# EAGLE design TX (EAGLE 6.5.0)
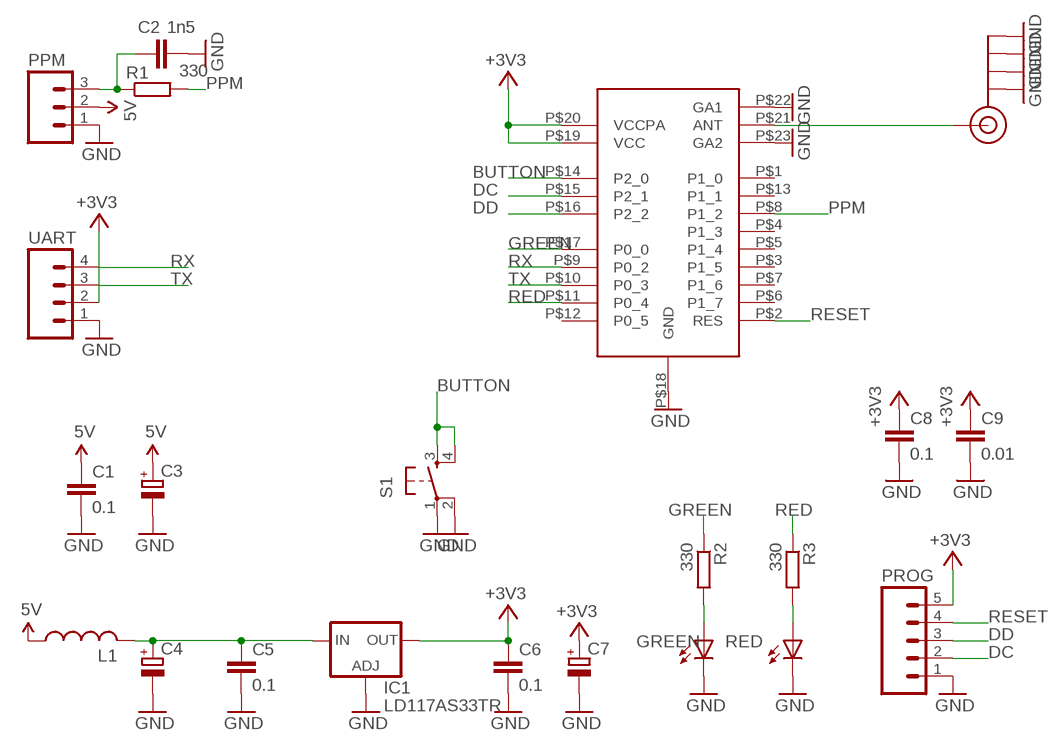
[diagram p0: schematic, sheet 1]

## Parts
C1  0.1  C-EUC0603  [C0603]
C2  1n5  C-EUC0603  [C0603]
C3  CPOL-EUCT3216  [CT3216]
C4  CPOL-EUCT3216  [CT3216]
C5  0.1  C-EUC0603  [C0603]
C6  0.1  C-EUC0603  [C0603]
C7  CPOL-EUCT3216  [CT3216]
C8  0.1  C-EUC0603  [C0603]
C9  0.01  C-EUC0603  [C0603]
GREEN  LEDCHIPLED_1206  [CHIPLED_1206]
IC1  LD117AS33TR  [SOT223]
J$1  SMA_EDGE  [SMA-EDGE]
L1  L-USL2012C  [L2012C]
PPM  M03PTH  [1X03]
PROG  M05PTH  [1X05]
R1  330  R-EU_MELF0102R  [MINI_MELF-0102R]
R2  330  R-EU_MELF0102R  [MINI_MELF-0102R]
R3  330  R-EU_MELF0102R  [MINI_MELF-0102R]
RED  LEDCHIPLED_1206  [CHIPLED_1206]
S1  TAC_SWITCHSMD  [TACTILE_SWITCH_SMD]
U$1  CC1110_PA  [CC1110_PA]
UART  M04PTH  [1X04]

## Nets
5V: C1.1 C3.+ L1.1 PPM.2
+3V3: C6.1 C7.+ C8.1 C9.1 IC1.4(OUT) PROG.5 U$1.P$19(VCC) U$1.P$20(VCCPA) UART.2
BUTTON: S1.3 S1.4 U$1.P$14(P2_0)
DC: PROG.2 U$1.P$15(P2_1)
DD: PROG.3 U$1.P$16(P2_2)
GND: C1.2 C2.2 C3.- C4.- C5.2 C6.2 C7.- C8.2 C9.2 GREEN.C IC1.1(ADJ) J$1.GND@0(GND) J$1.GND@1(GND) J$1.GND@2(GND) J$1.GND@3(GND) PPM.1 PROG.1 RED.C S1.1 S1.2 U$1.P$18(GND) U$1.P$22(GA1) U$1.P$23(GA2) UART.1
GREEN: R2.1 U$1.P$17(P0_0)
N$1: J$1.SIG(SIGNAL) U$1.P$21(ANT)
N$2: C4.+ C5.1 IC1.3(IN) L1.2
N$3: GREEN.A R2.2
N$4: R3.2 RED.A
N$9: C2.1 PPM.3 R1.1
PPM: R1.2 U$1.P$8(P1_2)
RED: R3.1 U$1.P$11(P0_4)
RESET: PROG.4 U$1.P$2(RES)
RX: U$1.P$9(P0_2) UART.4
TX: U$1.P$10(P0_3) UART.3
Unconnected: U$1.P$1(P1_0) U$1.P$3(P1_5) U$1.P$4(P1_3) U$1.P$5(P1_4) U$1.P$6(P1_7) U$1.P$7(P1_6) U$1.P$12(P0_5) U$1.P$13(P1_1)

## Library data of the parts
C1 C2 C5 C6 C8 C9 = resistor:C-EU: CAPACITOR, European symbol
C3 C4 C7 = rcl:CPOL-EU: POLARIZED CAPACITOR, European symbol
GREEN RED = led:LED: LED OSRAM: - CHIPLED LG R971, LG N971, LY N971, LG Q971, LY Q971, LO R971, LY R971 LH N974, LH R974 LS Q976, LO Q976, LY Q976 LO Q996 - Hyper CHIPLED LW Q18S LB Q993, LB Q99A, LB R99A - SideLED LS A670, LO A670, LY A670, LG A670, LP A670 LB A673, LV A673, LT A673, LW A673 LH A674 LY A675 LS A676, LA A676, LO A676, LY A676, LW A676 LS A679, LY A679, LG A679 - Hyper Micro SIDELED® LS Y876, LA Y876, LO Y876, LY Y876 LT Y87S - SmartLED LW L88C, LW L88S LB L89C, LB L89S, LG L890 LS L89K, LO L89K, LY L89K LS L896, LA L896, LO L896, LY L896 - TOPLED LS T670, LO T670, LY T670, LG T670, LP T670 LSG T670, LSP T670, LSY T670, LOP T670, LYG T670 LG T671, LOG T671, LSG T671 LB T673, LV T673, LT T673, LW T673 LH T674 LS T676, LA T676, LO T676, LY T676, LB T676, LH T676, LSB T676, LW T676 LB T67C, LV T67C, LT T67C, LS T67K, LO T67K, LY T67K, LW E67C LS E67B, LA E67B, LO E67B, LY E67B, LB E67C, LV E67C, LT E67C LW T67C LS T679, LY T679, LG T679 LS T770, LO T770, LY T770, LG T770, LP T770 LB T773, LV T773, LT T773, LW T773 LH T774 LS E675, LA E675, LY E675, LS T675 LS T776, LA T776, LO T776, LY T776, LB T776 LHGB T686 LT T68C, LB T68C - Hyper Mini TOPLED® LB M676 - Mini TOPLED Santana® LG M470 LS M47K, LO M47K, LY M47K Source: http://www.osram.convergy.de LUXEON: - LUMILED® LXK2-PW12-R00, LXK2-PW12-S00, LXK2-PW14-U00, LXK2-PW14-V00 LXK2-PM12-R00, LXK2-PM12-S00, LXK2-PM14-U00 LXK2-PE12-Q00, LXK2-PE12-R00, LXK2-PE12-S00, LXK2-PE14-T00, LXK2-PE14-U00 LXK2-PB12-K00, LXK2-PB12-L00, LXK2-PB12-M00, LXK2-PB14-N00, LXK2-PB14-P00, LXK2-PB14-Q00 LXK2-PR12-L00, LXK2-PR12-M00, LXK2-PR14-Q00, LXK2-PR14-R00 LXK2-PD12-Q00, LXK2-PD12-R00, LXK2-PD12-S00 LXK2-PH12-R00, LXK2-PH12-S00 LXK2-PL12-P00, LXK2-PL12-Q00, LXK2-PL12-R00 Source: www.luxeon.com KINGBRIGHT: KA-3528ASYC Source: www.kingbright.com
IC1 = v-reg:LD117A?*: Low drop fixed and adjustable positive voltage regulators 1 A Source: http://www.st.com/stonline/products/literature/ds/7194/ld1117axx.pdf
J$1 = SparkFun:SMA_EDGE: SMA Antenna Connector End launch SMA connector. The paste layer has been removed so that the connector can be hand soldered onto the board after reflow.
L1 = resistor:L-US: INDUCTOR, American symbol
PPM = SparkFun-Connectors:M03: Header 3 Standard 3-pin 0.1" header. Use with straight break away headers (SKU : PRT-00116), right angle break away headers (PRT-00553), swiss pins (PRT-00743), machine pins (PRT-00117), and female headers (PRT-00115). Molex polarized connector foot print use with SKU : PRT-08232 with associated crimp pins and housings.
PROG = SparkFun-Connectors:M05: Header 5 Standard 5-pin 0.1" header. Use with straight break away headers (SKU : PRT-00116), right angle break away headers (PRT-00553), swiss pins (PRT-00743), machine pins (PRT-00117), and female headers (PRT-00115). Molex polarized connector foot print use with SKU : PRT-08230 with associated crimp pins and housings.
R1-R3 = resistor:R-EU_: RESISTOR, European symbol
S1 = SparkFun-Electromechanical:TAC_SWITCH: Momentary Switch Button commonly used for reset or general input. Spark Fun Electronics SKU : COM-00097 SMT- SWCH-08247; PROD_ID: SWCH-08247
U$1 = Stefan:CC1110_PA
UART = SparkFun-Connectors:M04: Header 4 Standard 4-pin 0.1" header. Use with straight break away headers (SKU : PRT-00116), right angle break away headers (PRT-00553), swiss pins (PRT-00743), machine pins (PRT-00117), and female headers (PRT-00115). Molex polarized connector foot print use with SKU : PRT-08231 with associated crimp pins and housings. 1MM SMD Version SKU: PRT-10208

## Board
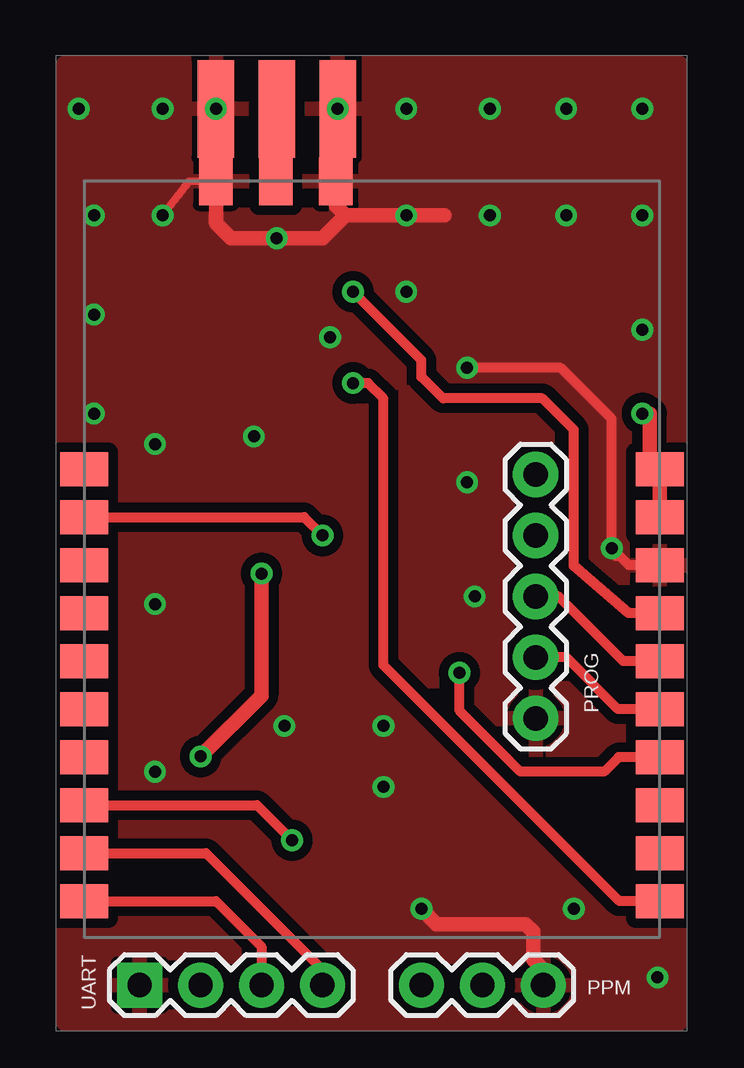
[diagram p1: board, top side]
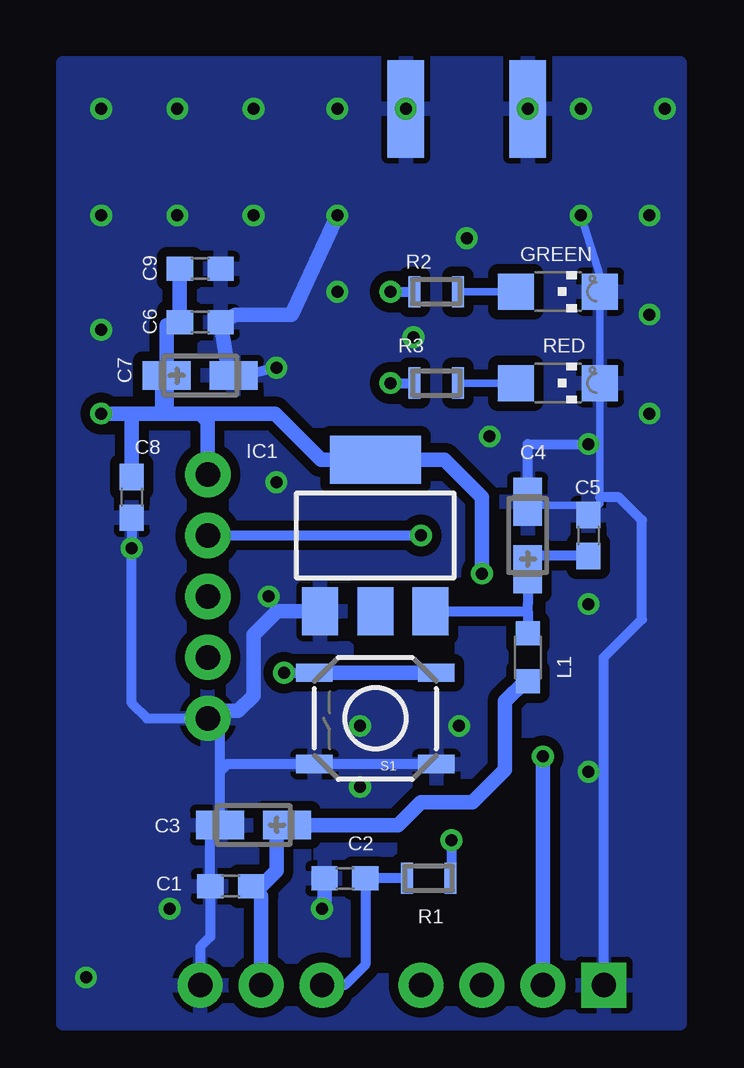
[diagram p2: board, bottom side, seen from below]

No outline drawn. Coordinates in mm, seen from the top.
Copper layers (1*16): Top 0.035mm / dielectric 1.5mm / Bottom 0.035mm
Design rules "default *": minimum track width 10mil, minimum drill 24mil, track to track 8mil, track to pad 8mil, pad to pad 8mil, via to via 8mil, smd to smd 8mil, copper to edge 40mil, drill to drill 8mil, minimum pad ring 10mil, minimum via ring 8mil, stop-mask expansion 4mil, vias tented up to drill 20mil, thermal gap 10mil

### Footprints (pad centres in the part's own frame; a part is rotated, then mirrored left to right if it is on the bottom)
C0603 = smd 1.1 x 1: 1 -0.85,0; 2 0.85,0
CT3216 = smd 2 x 1.2: + -1.4,0; - 1.4,0
CHIPLED_1206 = smd 1.5 x 1.5: A 0,-1.75; C 0,1.75
SOT223 = smd 1.5 x 2: 1 -2.3,-3.15; 2 0,-3.15; 3 2.3,-3.15 | smd 3.8 x 2: 4 0,3.15
SMA-EDGE = smd 1.524 x 4.064: GND@0 0,0; GND@1 5.08,0; SIG 2.54,0 | smd 1.524 x 4.064 bottom: GND@2 0,0; GND@3 5.08,0
L2012C = smd 1 x 1: 1 -1,0; 2 1,0
1X03 = drill 1.016 pad 1.88: 1 0,0; 2 2.54,0; 3 5.08,0
1X05 = drill 1.016 pad 1.88: 1 0,0; 2 2.54,0; 3 5.08,0; 4 7.62,0; 5 10.16,0
MINI_MELF-0102R = smd 0.5 x 1.3: 1 -0.9,0; 2 0.9,0
TACTILE_SWITCH_SMD = smd 1.524 x 0.762: 1 -2.54,1.905; 2 2.54,1.905; 3 -2.54,-1.905; 4 2.54,-1.905
CC1110_PA = smd 2 x 1.4: P$1 -5.5,18; P$2 -5.5,16; P$3 -5.5,14; P$4 -5.5,12; P$5 -5.5,10; P$6 -5.5,8; P$7 -5.5,6; P$8 -5.5,4; P$9 -5.5,2; P$10 -5.5,0; P$11 18.5,0; P$12 18.5,2; P$13 18.5,4; P$14 18.5,6; P$15 18.5,8; P$16 18.5,10; P$17 18.5,12; P$18 18.5,14; P$19 18.5,16; P$20 18.5,18 | smd 1.4 x 2: P$21 2.5,30; P$22 0,30; P$23 5,30
1X04 = drill 1.016 pad 1.88 square: 1 0,0 | drill 1.016 pad 1.88: 2 2.54,0; 3 5.08,0; 4 7.62,0

### Placement (x,y rotation side)
C1  20,12.06 180 bottom
C2  15.24,12.38 180 bottom
C3  19.05,14.61 180 bottom
C4  7.62,26.67 90 bottom
C5  5.08,26.67 90 bottom
C6  21.27,35.56 0 bottom
C7  21.27,33.34 0 bottom
C8  24.13,28.26 270 bottom
C9  21.27,37.78 0 bottom
GREEN  6.35,36.83 270 bottom
IC1  13.97,26.67 0 bottom
J$1  7.62,44.45 0 top
L1  7.62,21.59 90 bottom
PPM  21.27,7.94 180 top
PROG  20.95,19.05 90 top
R1  11.75,12.38 0 bottom
R2  11.43,36.83 0 bottom
R3  11.43,33.02 0 bottom
RED  6.35,33.02 270 bottom
S1  13.97,19.05 180 bottom
U$1  7.62,11.43 0 top
UART  4.45,7.94 0 top

### Tracks (layer width: path | path; a pad name or v marks a point on that pad's centre or on a via)
5V
  Bottom 0.61: PPM.2 18.73,11.64 C1.1 18.73,12.06 18.1,12.7 18.1,14.16 C3.+ 13.02,14.61 12.06,15.56 9.92,15.56 8.57,16.91 8.57,19.77 7.71,20.59 L1.1
+3V3  (via drill 0.5)
  Top 0.61: U$1.P$19 U$1.P$20 25.5,29.43 25.72,29.53 25.72,31.75 v25.4,31.75 | v9.53,25.08 9.53,20 v6.99,17.46
  Bottom 0.61: C8.1 24.13,31.75 v25.4,31.75 22.86,31.75 | 21.27,31.75 18.16,31.75 16.23,29.82 IC1.4 11.09,29.82 9.53,28.26 v9.53,25.08 | 21.27,31.75 22.86,31.75 | 22.86,31.75 22.86,33.15 C7.+ | C7.+ 22.67,35.43 22.23,35.56 arc-90 22.12,35.66 | 22.12,35.66 C6.1 | C7.+ 22.67,31.94 22.86,31.75 | v6.99,17.46 UART.2 | PROG.5 20.95,31.43 21.27,31.75 | 22.12,35.66 C9.1
BUTTON  (via drill 0.5)
  Top 0.406: U$1.P$14 24.41,17.43 23.81,16.83 20.32,16.83 17.78,19.37 v17.78,20.95
  Bottom 0.406: v17.78,20.95 S1.4
  Bottom 0.61: S1.3 S1.4
DC
  Top 0.406: U$1.P$15 24.39,19.43 22.23,21.59 PROG.2
DD
  Top 0.406: U$1.P$16 24.61,21.43 21.91,24.13 PROG.3
GND  (via drill 0.5)
  Top 0.305: U$1.P$22 6.5,41.43 v5.4,40.01
  Top 0.406: U$1.P$18 24.84,25.43 v24.13,26.14 | v24.13,26.14 24.13,31.52 22,33.66 v18.1,33.66 | v24.13,26.14 24.13,25.99 24.31,25.82
  Top 0.61: 13.02,40.01 12.62,40.4 U$1.P$23 12.62,44.37 J$1.GND@3 | 13.02,40.01 v15.56,40.01 17.14,40.01 | v16.19,11.11 16.83,10.48 20.54,10.48 20.85,10.16 20.85,8.99 21.27,8.57 PPM.1 | U$1.P$22 J$1.GND@2 7.62,39.69 8.26,39.05 12.06,39.05 13.02,40.01
  Bottom 0.305: v5.4,40.01 4.45,36.98 GREEN.C RED.C 4.6,28.26 4.6,28 C5.2 5.08,27.62 5.4,27.94 7.49,27.94 C4.-
  Bottom 0.406: v18.1,33.66 20,33.21 C7.- | C8.2 v24.13,26.14 24.13,19.68 23.5,19.05 PROG.1 | 20.45,16.83 C3.- 20.85,14.2 C1.2 20.85,9.95 21.27,9.53 PPM.1 | 20.45,16.83 20.45,18.55 PROG.1 | S1.1 S1.2 20.13,17.14 20.45,16.83 | UART.1 4.45,21.59 2.86,23.18 2.86,27.3 3.81,28.26 4.6,28.26 | 20.64,19.37 PROG.1 | C4.- 7.62,30.48 v5.08,30.48
  Bottom 0.61: C7.- 20.11,33.57 C6.2 19.79,35.88 17.46,35.88 v15.56,40.01 | C2.2 16.09,11.21 v16.19,11.11 | IC1.1 18.07,23.52 19.05,22.54 19.05,20 19.68,19.37 20.64,19.37
  other vias: 5.4,44.45 15.56,44.45 19.05,44.45 25.4,44.45 26.04,8.26 5.08,23.81 25.4,35.24 25.4,40.01 2.54,35.88 18.1,28.89 9.21,30.8 14.61,18.73 1.91,44.45 19.05,40.01 15.56,36.83 2.54,31.75 2.54,40.01 18.41,24.13 22.54,11.11 5.08,16.83 10.16,39.05 12.38,34.92 14.61,16.19 10.48,18.73 22.23,44.45 22.23,40.01 7.62,44.45 12.7,44.45
  pour Top (isolate 0.406): 1.27,46.35 26.99,46.35 26.99,6.35 1.27,6.35
  pour Bottom (isolate 0.406): 1.27,46.35 1.27,6.35 26.99,6.35 26.99,46.35
GREEN  (via drill 0.5)
  Top 0.406: U$1.P$17 24.83,23.43 22.54,25.4 22.54,31.08 21.23,32.38 17.09,32.38 16.19,33.28 16.19,33.97 v13.34,36.83
  Bottom 0.406: v13.34,36.83 R2.1
N$1
  Top 0.61: U$1.P$21 10.12,44.41 J$1.SIG
N$2
  Bottom 0.406: C5.1 7.62,25.82 C4.+ 7.62,23.81 7.62,23.52 | 7.62,23.52 L1.2 | IC1.3 7.62,23.52
N$3
  Bottom 0.305: GREEN.A R2.2
N$4
  Bottom 0.305: RED.A R3.2
N$9
  Bottom 0.406: R1.1 C2.1 14.39,8.79 15.24,7.94 PPM.3
PPM  (via drill 0.5)
  Top 0.406: U$1.P$8 9.34,15.43 v10.79,13.97
  Bottom 0.406: v10.79,13.97 10.79,12.44 R1.2
RED  (via drill 0.5)
  Top 0.406: U$1.P$11 24.45,11.43 14.61,21.27 14.61,30.48 14.61,32.38 13.97,33.02 v13.34,33.02
  Bottom 0.406: v13.34,33.02 R3.1
RESET  (via drill 0.5)
  Top 0.406: U$1.P$2 11.3,27.43 v12.06,26.67
  Bottom 0.406: PROG.4 v12.06,26.67
RX
  Top 0.406: U$1.P$9 7.21,13.43 12.06,8.57 UART.4
TX
  Top 0.406: U$1.P$10 7.62,11.43 9.53,9.53 UART.3